# Altium schematic sheet Precharge.SchDoc
size A; SheetNumber: 4; SheetTotal: 5
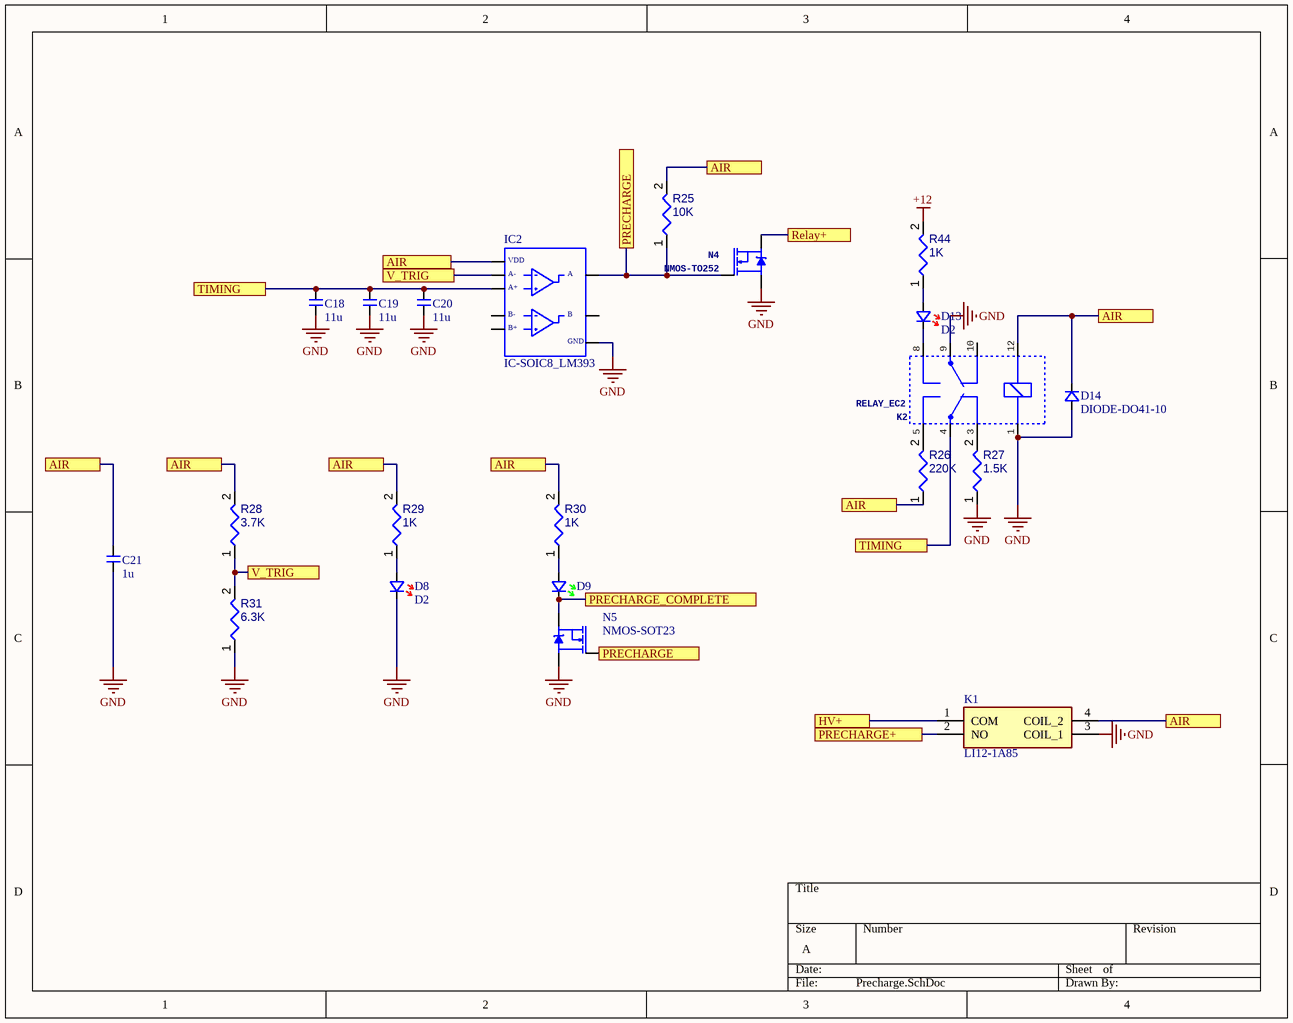
[diagram p0: Precharge.SchDoc]

## Parts
C18  11u  [CAP-0603]
C19  11u  [CAP-0603]
C20  11u  [CAP-0603]
C21  1u  [CAP-0603]
D8  D2  [LEDRED-0603]
D9  LEDGREEN-1806-RIGHT  [LEDGREEN-1806-RIGHT]  (value not drawn)
D13  D2  [LEDRED-0603]
D14  DIODE-DO41-10  [DO41-10]
IC2  IC-SOIC8_LM393  [SOIC8]
K1  LI12-1A85  [LI121A85]
K2  RELAY_EC2  [RELAY-DPDT_EC2]
N4  NMOS-TO252  [TO252]
N5  NMOS-SOT23  [SOT23]
R25  10K  [RESC0805(2012)_L]
R26  220K  [RESC0805(2012)_L]
R27  1.5K  [RESC0805(2012)_L]
R28  3.7K  [RESC0805(2012)_L]
R29  1K  [RESC0805(2012)_L]
R30  1K  [RESC0805(2012)_L]
R31  6.3K  [RESC0805(2012)_L]
R44  1K  [RESC0805(2012)_L]

## Ports
AIR, HV+, PRECHARGE, PRECHARGE+, PRECHARGE_COMPLETE, Relay+, TIMING, V_TRIG

## Nets
+12: R44.2
GND: C18.2 C19.2 C20.2 C21.2 D8.K D14.A IC2.4 K1.3(COIL_1) K2.1 K2.9 N4.2(S) N5.2(S) R27.1 R31.1
AIR: C21.1 D14.K IC2.8 K1.4(COIL_2) K2.12 R25.2 R26.1 R28.2 R29.2 R30.2 ; port AIR
HV+: K1.1(COM) ; port HV+
PRECHARGE: IC2.1 N4.1(G) N5.1(G) R25.1 ; port PRECHARGE
PRECHARGE+: K1.2(NO) ; port PRECHARGE+
PRECHARGE_COMPLETE: D9.K N5.3(D) ; port PRECHARGE_COMPLETE
Relay+: N4.3(D) ; port Relay+
TIMING: C18.1 C19.1 C20.1 IC2.3 K2.4 ; port TIMING
V_TRIG: IC2.2 R28.1 R31.2 ; port V_TRIG
NetD8_A: D8.A R29.1
NetD9_A: D9.A R30.1
NetD13_A: D13.A R44.1
NetD13_K: D13.K K2.8
NetK2_3: K2.3 R27.2
NetK2_5: K2.5 R26.2

Not connected (* = marked no-connect by the designer): IC2 5 6 7; K2 10

## Notes on the sheet
- (in symbol CMP-056-000403-1) VDD; A-; A; A+; B-; B; B+; GND

## Library data of the parts
C18-C21 = CMP-050-000018-1: Design Item ID: CAP-0603; Source: ife19_Elec_Library.SchLib
D8 D13 = CMP-056-000392-1: Design Item ID: LEDRED-0603; Source: ife19_Elec_Library.SchLib
D9 = CMP-056-000417-1: Source: ife19_Elec_Library.SchLib; Design Item ID: LEDGREEN-1806-RIGHT
D14 = CMP-051-000053-1: Source: ife19_Elec_Library.SchLib; Design Item ID: DIODE-DO41-10
IC2 = CMP-056-000403-1: Design Item ID: IC-SOIC8_LM393; Source: ife19_Elec_Library.SchLib
K1 = LI12-1A85: Relay or Contactor; Manufacturer_Name: STANDEXMEDER; Datasheet Link: https://standexelectronics.com/resources/technical-library/technical-papers/datasheet-li-series-reed-relay/; Height: 10.4mm; Manufacturer_Part_Number: LI12-1A85; Mouser Part Number: 876-LI12-1A85; Arrow Part Number: LI12-1A85; Arrow Price/Stock: https://www.arrow.com/en/products/li12-1a85/standex-meder-electronics?region=nac
K2 = CMP-056-000384-1: SymbolName_1: MONOSTABLERELAY; DeviceSetName: EC2; GateName_1: G$1; LibraryName: KEMET; Source: ife19_Elec_Library.SchLib; Design Item ID: RELAY_EC2; Package: DPDT_2.54
N4 = CMP-056-000388-1: SymbolName_1: LABELED-PMOS; DeviceSetName: DMP10H400SK3-13; GateName_1: G$1; Source: ife19_Elec_Library.SchLib; LibraryName: IFE_Transistors; Package: TO252; Design Item ID: NMOS-TO252
N5 = CMP-056-000387-1: Source: ife19_Elec_Library.SchLib; Design Item ID: NMOS-SOT23
R25-R31 R44 = CMP-009-000150-1: Chip Resistor, 43,2 kOhms, +/-1 %, 63 mW, -55 to 155 degC, 0402; Available Preview Images: 2D; Source: Integrated_Library - 12.03.21 - 15.39.SchLib; Design Item ID: CMP-009-00154-2